# EAGLE design GrooveGrid (EAGLE 8.3.1)
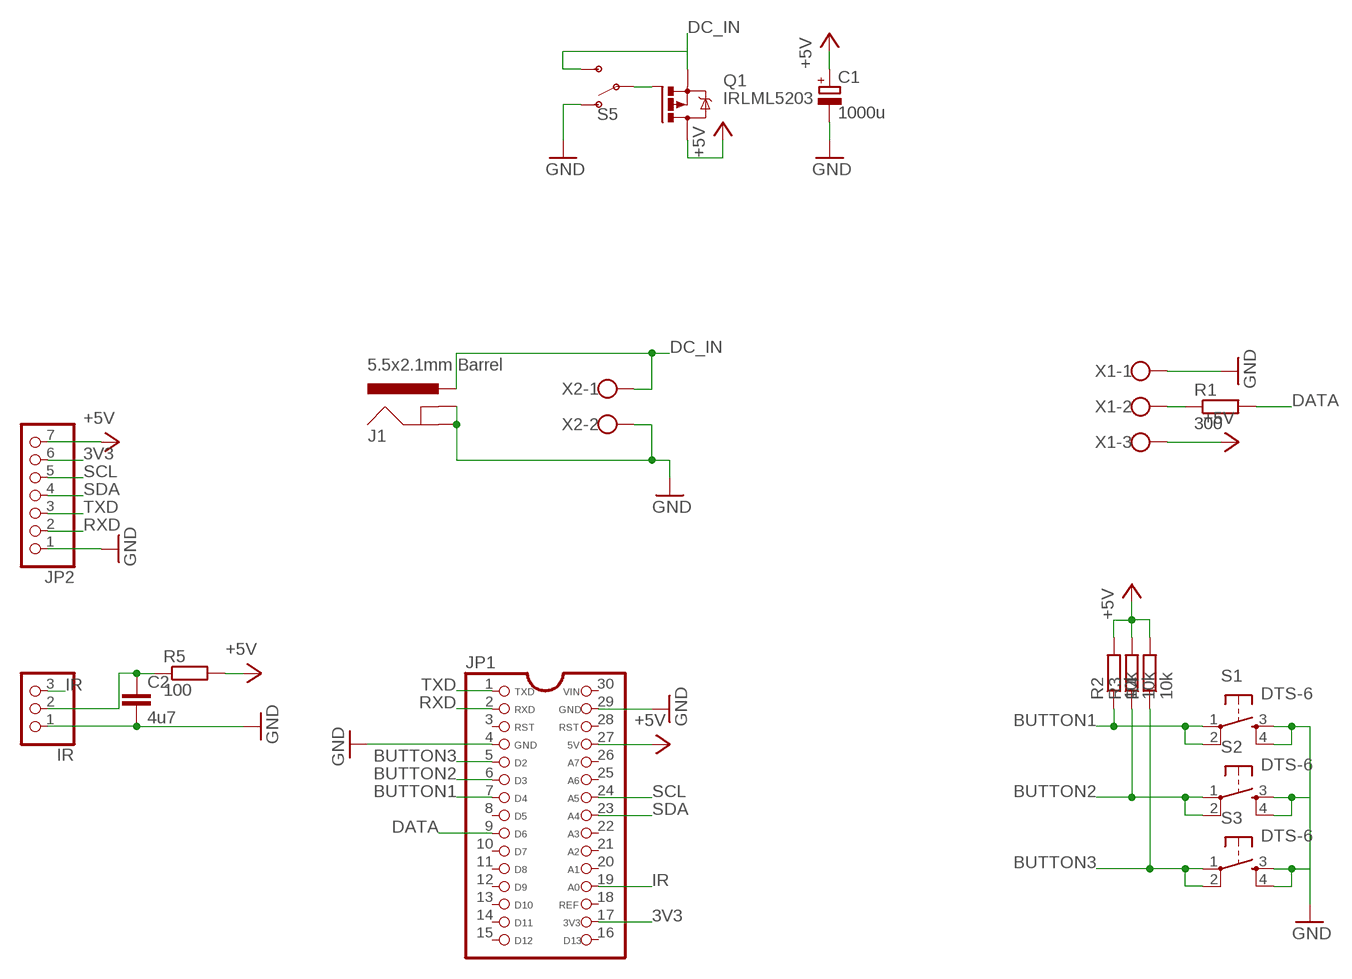
[diagram p0: schematic, sheet 1]

## Parts
C1  1000u  CPOL-EUE3.5-10  [E3,5-10]
C2  4u7  C-EUC0805  [C0805]
IR  PINHD-1X3  [1X03]
J1  5.5x2.1mm Barrel  POWER_JACKSMD  [POWER_JACK_SMD]
JP1  ATMEGA_NANO_MODULE  [ATMEGA_NANO_MODULE]
JP2  PINHD-1X7  [1X07]
Q1  IRLML5203  [MICRO3]
R1  300  R-EU_M0805  [M0805]
R2  10k  R-EU_M0805  [M0805]
R3  10k  R-EU_M0805  [M0805]
R4  10k  R-EU_M0805  [M0805]
R5  100  R-EU_M0805  [M0805]
S1  DTS-6  [DTS-6]
S2  DTS-6  [DTS-6]
S3  DTS-6  [DTS-6]
S5  SWITCH-SPDT-PTH-11.6X4.0MM  [SWITCH_SPDT_PTH_11.6X4.0MM]
X1  W237-103  [W237-103]
X2  W237-102  [W237-102]

## Nets
3V3: JP1.17 JP2.6
+5V: C1.+ JP1.27 JP2.7 Q1.3(D) R2.2 R3.2 R4.2 R5.2 X1.3
BUTTON1: JP1.7 R2.1 S1.1 S1.2
BUTTON2: JP1.6 R3.1 S2.1 S2.2
BUTTON3: JP1.5 R4.1 S3.1 S3.2
DATA: JP1.9 R1.2
DC_IN: J1.VIN0(PWR) Q1.2(S) S5.3(S) X2.1
GND: C1.- C2.2 IR.1 J1.GND(GNDBREAK) J1.P$4(GND) JP1.4 JP1.29 JP2.1 S1.3 S1.4 S2.3 S2.4 S3.3 S3.4 S5.1(O) X1.1 X2.2
IR: IR.3 JP1.19
N$1: C2.1 IR.2 R5.1
N$3: R1.1 X1.2
N$5: Q1.1(G) S5.2(P)
RXD: JP1.2 JP2.2
SCL: JP1.24 JP2.5
SDA: JP1.23 JP2.4
TXD: JP1.1 JP2.3
Unconnected: JP1.3 JP1.8 JP1.10 JP1.11 JP1.12 JP1.13 JP1.14 JP1.15 JP1.16 JP1.18 JP1.20 JP1.21 JP1.22 JP1.25 JP1.26 JP1.28 JP1.30

## Library data of the parts
C1 = resistor:CPOL-EU: POLARIZED CAPACITOR, European symbol
C2 = resistor:C-EU: CAPACITOR, European symbol
IR = pinhead:PINHD-1X3: PIN HEADER
J1 = SparkFun-Connectors:POWER_JACK: Power Jack Connector This is the standard 5.5mm barrel jack for power. The PTH is the most common, proven, reliable, footprint. The Slot footprint only works if the mill layer is transmitted to the PCB fab house so be warned. Here are the connectors we sell at SparkFun: DC Barrel Power Jack/Connector <https://www.sparkfun.com/products/119> (PRT-00119) DC Barrel Power Jack/Connector (SMD) <https://www.sparkfun.com/products/12748> (PRT-12748) DC Barrel Jack Adapter - Breadboard Compatible <https://www.sparkfun.com/products/10811> (PRT-10811) It is used on this SparkFun product (and many, many others): SparkFun RedBoard - Programmed with Arduino <https://www.sparkfun.com/products/12757> (DEV-12757) Also, if you need a mating power supply or connector, please check these out: Wall Adapter Power Supply - 9VDC 650mA <https://www.sparkfun.com/products/298> (TOL-00298) DC Barrel Jack Adapter - Male <https://www.sparkfun.com/products/10287> (PRT-10287); PROD_ID: CONN-08106; SF_ID: PRT-12748
JP1 = phoggy:ATMEGA_NANO_MODULE: PIN HEADER
JP2 = pinhead:PINHD-1X7: PIN HEADER
Q1 = transistor-power:IRLML5203: HEXFET P-Channel Power MOSFET
R1-R5 = resistor:R-EU_: RESISTOR, European symbol
S1-S3 = switch-tact:DTS-6
S5 = SparkFun-Switches:SWITCH-SPDT: Single Pole, Double Throw (SPDT) Switch Single-pole, double-throw (SPDT) switch. Variant Overview SMD-AYZ0202 Surface Mount DPDT Switch <https://www.sparkfun.com/products/597> (COM-00597) Used on e.g. LilyPad Arduino USB - ATmega32U4 Board <https://www.sparkfun.com/products/12049> PTH-11.6X4.0MM SPDT Mini Power Switch <https://www.sparkfun.com/products/102> (COM-00102) Used on e.g. SparkFun Simon Says - Through-Hole Soldering Kit <https://www.sparkfun.com/products/10547> (KIT-10547) PTH-11.6X4.0MM-KIT KIT version of SPDT Mini Power Switch - Simplifies soldering by removing tStop of switch pins - only one side can be soldered. PTH-11.6X4.0MM-LOCK LOCK version of SPDT Mini Power Switch - Offset pins hold switch in place for easier soldering. SMD-RIGHT-ANGLE Surface Mount Right Angle Switch <https://www.sparkfun.com/products/10860> (COM-10860) Used on e.g. SparkFun ESP8266 Thing <https://www.sparkfun.com/products/13231>; PROD_ID: SWCH-08261; SF_SKU: COM-00102
X1 = con-wago-500:W237-103: WAGO SCREW CLAMP; MPN: 237-103; OC_FARNELL: unknown; OC_NEWARK: 18M7116
X2 = con-wago-500:W237-102: WAGO SCREW CLAMP; MPN: 237-102; OC_FARNELL: unknown; OC_NEWARK: 70K9898

## Board
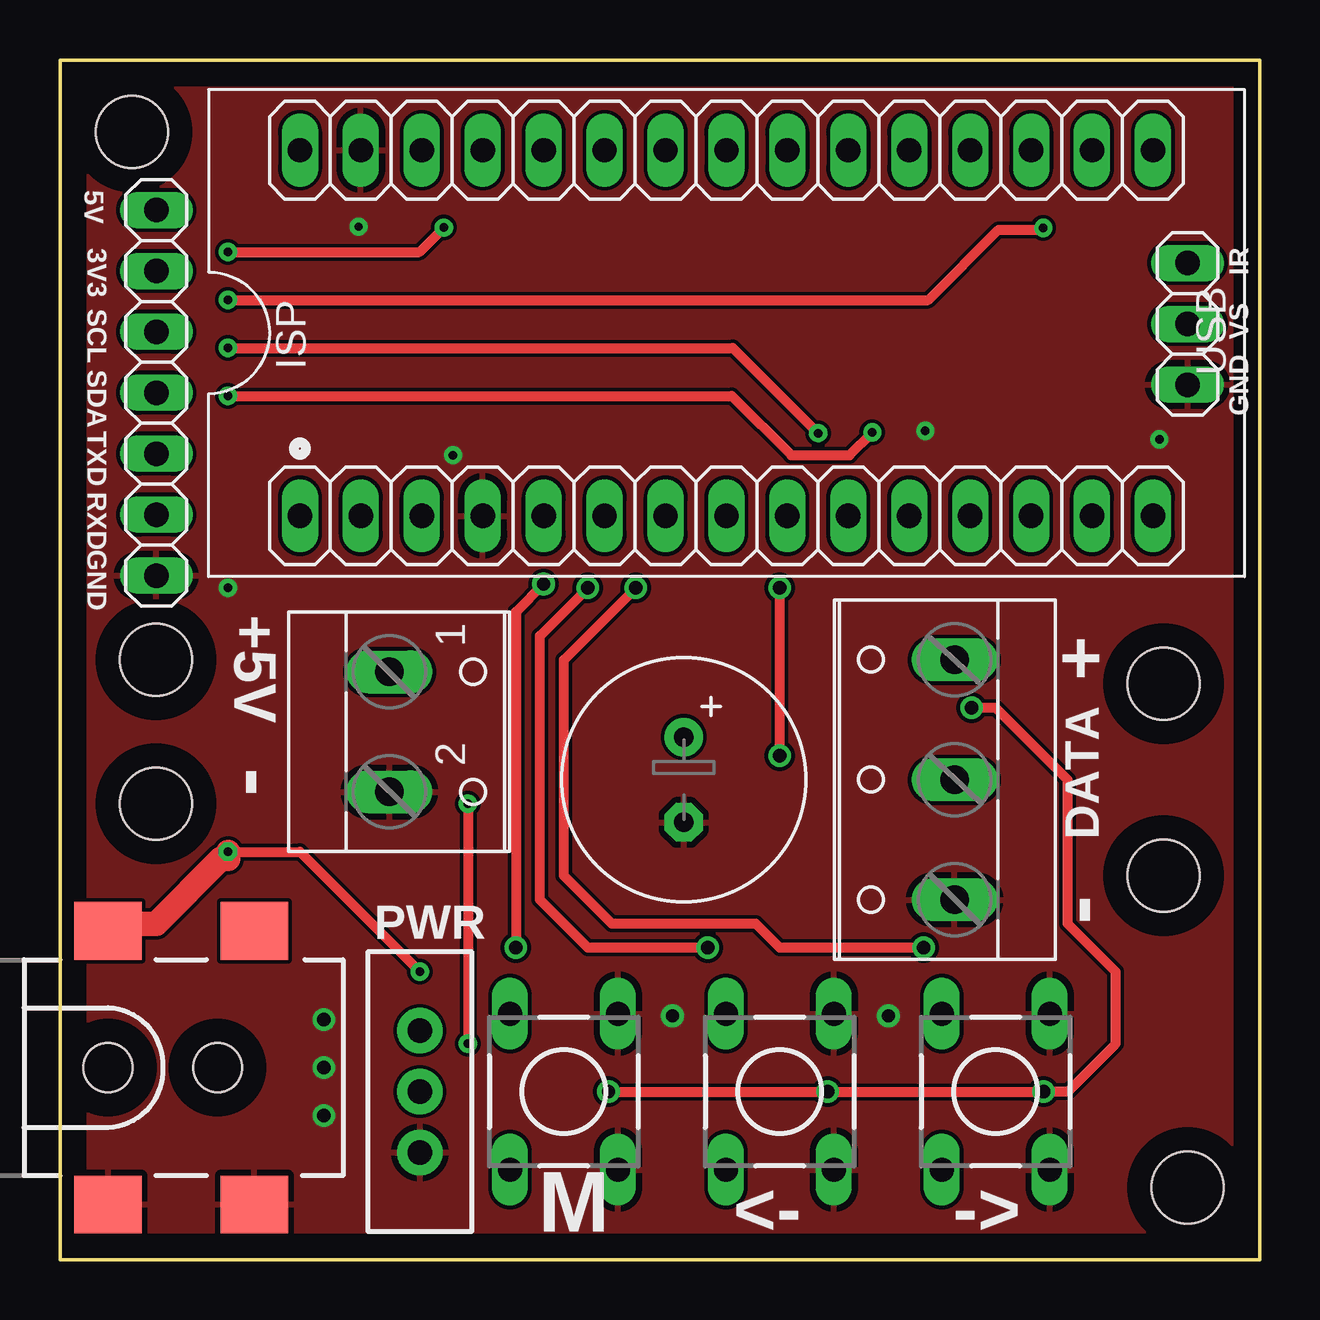
[diagram p1: board, top side]
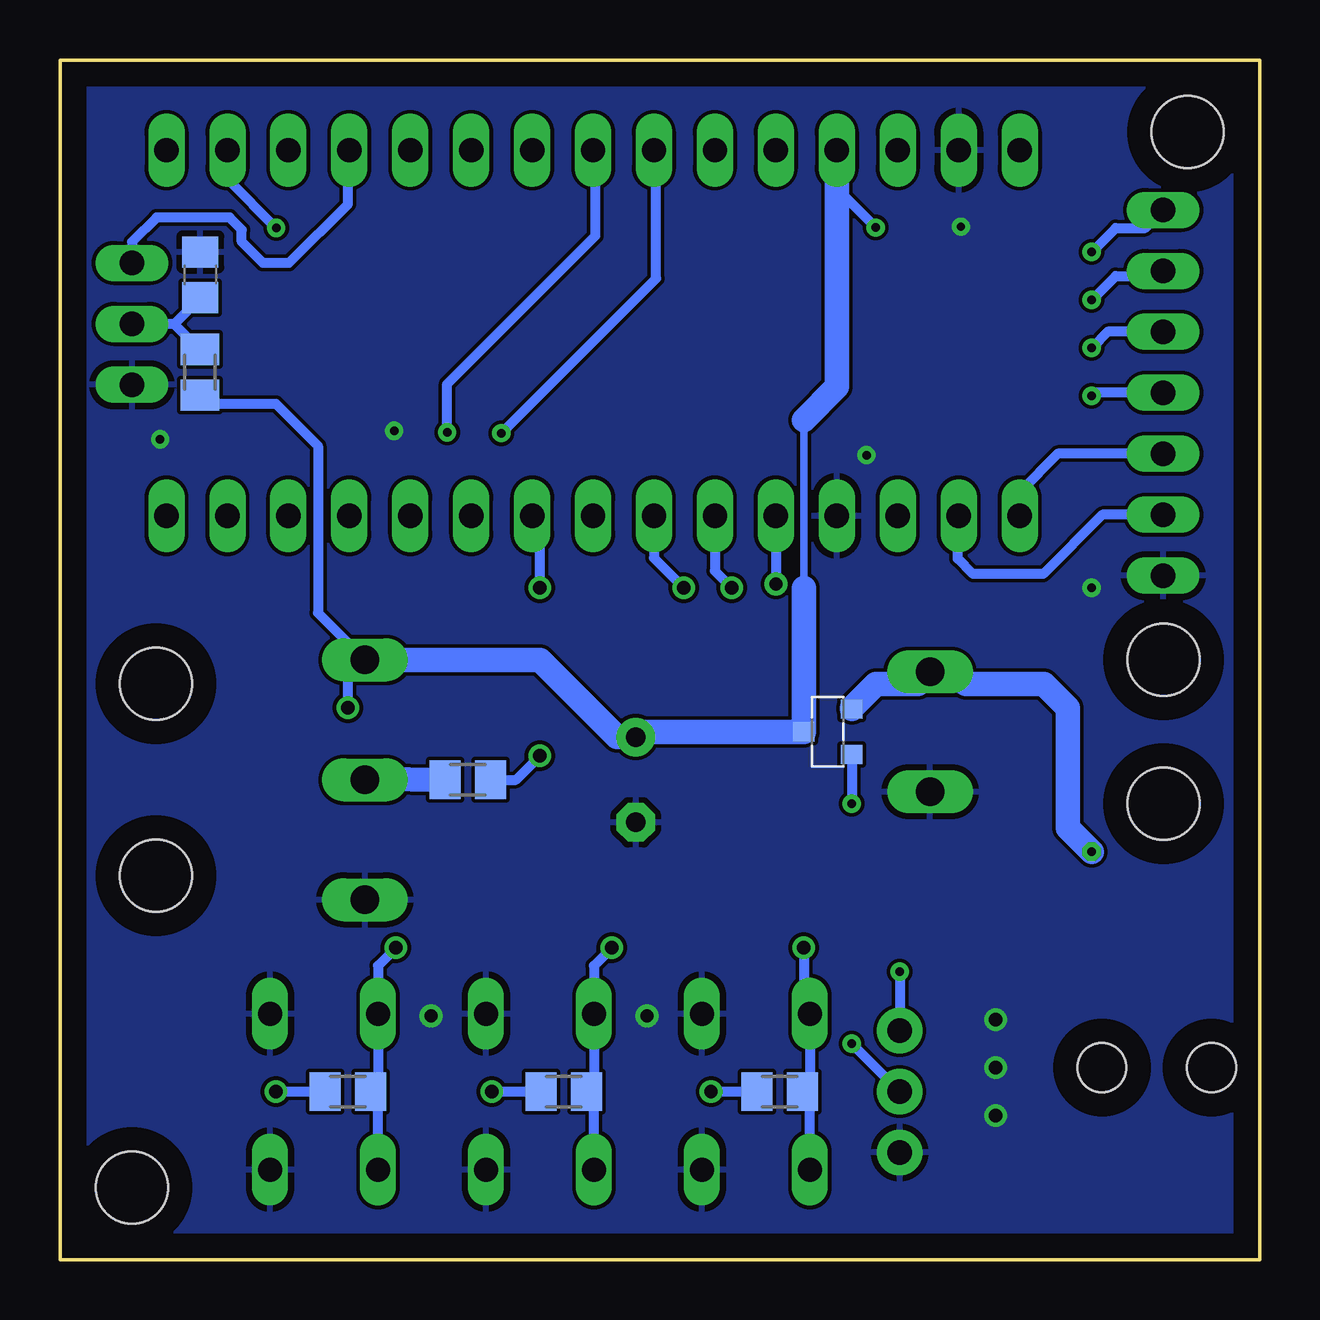
[diagram p2: board, bottom side, seen from below]

Size 50 x 50 mm. Coordinates in mm from the lower left corner, seen from the top.
Outline: 0,0 0,50 50,50 50,0 0,0
Copper layers (1*16): Top 0.035mm / dielectric 1.5mm / Bottom 0.035mm
Design rules "default": minimum track width 6mil, minimum drill 0.35mm, track to track 6mil, track to pad 6mil, pad to pad 6mil, via to via 6mil, smd to smd 6mil, copper to edge 40mil, drill to drill 6mil, minimum pad ring 10mil, minimum via ring 8mil, stop-mask expansion 4mil, vias tented up to drill 0mil, thermal gap 10mil
Holes 3 mm at 3,47 47,3 4,25 4,19 46,16 46,24

### Footprints (pad centres in the part's own frame; a part is rotated, then mirrored left to right if it is on the bottom)
E3,5-10 = drill 0.813 pad 1.6: + -1.778,0 | drill 0.813 pad 1.6 octagon: - 1.778,0
C0805 = smd 1.3 x 1.5: 1 -0.95,0; 2 0.95,0
1X03 = drill 1.016 long: 1 -2.54,0; 2 0,0; 3 2.54,0
POWER_JACK_SMD = smd 2.8 x 2.4: GND 0,-5.7; P$4 6.1,-5.7; VIN0 0,5.7; VIN1 6.1,5.7 | hole 2.032: 0,0; 4.572,0
ATMEGA_NANO_MODULE = drill 1.016 long: 1 0,0; 2 0,-2.54; 3 0,-5.08; 4 0,-7.62; 5 0,-10.16; 6 0,-12.7; 7 0,-15.24; 8 0,-17.78; 9 0,-20.32; 10 0,-22.86; 11 0,-25.4; 12 0,-27.94; 13 0,-30.48; 14 0,-33.02; 15 0,-35.56; 16 15.24,-35.56; 17 15.24,-33.02; 18 15.24,-30.48; 19 15.24,-27.94; 20 15.24,-25.4; 21 15.24,-22.86; 22 15.24,-20.32; 23 15.24,-17.78; 24 15.24,-15.24; 25 15.24,-12.7; 26 15.24,-10.16; 27 15.24,-7.62; 28 15.24,-5.08; 29 15.24,-2.54; 30 15.24,0
1X07 = drill 1.016 long: 1 -7.62,0; 2 -5.08,0; 3 -2.54,0; 4 0,0; 5 2.54,0; 6 5.08,0; 7 7.62,0
MICRO3 = smd 0.8 x 0.9: 1 -0.95,-1; 2 0.95,-1; 3 0,1
M0805 = smd 1.3 x 1.6: 1 -0.95,0; 2 0.95,0
DTS-6 = drill 1 long: 1 -3.25,2.25; 2 3.25,2.25; 3 -3.25,-2.25; 4 3.25,-2.25
SWITCH_SPDT_PTH_11.6X4.0MM = drill 1.016 pad 1.88: 1 0,2.54; 2 0,0; 3 0,-2.54
W237-103 = drill 1.194 long: 1 -5,-1.29; 2 0,-1.29; 3 5,-1.29
W237-102 = drill 1.194 long: 1 -2.5,-1.27; 2 2.5,-1.27

### Placement (x,y rotation side)
C1  26,20 270 top
C2  44.15,41.04 90 bottom
IR  47,39 90 top
J1  2,8 0 top
JP1  10,31 90 top
JP2  4.02,36.13 90 top
Q1  18,22 90 bottom
R1  33,20 0 bottom
R2  38,7 180 bottom
R3  29,7 180 bottom
R4  20,7 180 bottom
R5  44.17,36.98 270 bottom
S1  39,7 90 top
S2  30,7 90 top
S3  21,7 90 top
S5  15,7 180 top
X1  36,20 90 top
X2  15,22 270 top

### Tracks (layer width: path | path; a pad name or v marks a point on that pad's centre or on a via)
3V3  (via drill 0.35)
  Top 0.406: v40.98,43 40.91,42.93 39.12,42.93 36.19,40 v7,40
  Bottom 0.406: v7,40 6,41 4.22,41 JP2.6 | 43,46.22 JP1.17 43.02,45.04 v40.98,43
+5V  (via drill 0.35, 0.55)
  Top 0.406: v22.86,7 v32,7 v41,7 42,7 44,9 44,12 42,14 42,20 39,23 v38,23 | v7,42 14.98,42 v16,43.02
  Bottom 0.305: 19,35 19,28
  Bottom 0.406: R4.2 v22.86,7 23,7 | R3.2 v32,7 | R2.2 v41,7 | v38,23 38,24.71 X1.3 39.24,26.95 39.24,33.91 41,35.67 43.8,35.67 R5.2 | v7,42 6,43 4.76,43 JP2.7 | JP1.27 17.62,44.64 v16,43.02
  Bottom 1.016: 38,25 X1.3 30,25 26.78,21.78 C1.+ 25.78,22 Q1.3 19,28 | JP1.27 17.62,36.38 19,35
BUTTON1  (via drill 0.55)
  Top 0.406: v36,13 30,13 29,14 23,14 21,16 21,25 v24,28
  Bottom 0.406: v36,13 36.75,12.25 S1.2 36.75,7.3 R2.1 36.75,6.7 S1.1 | JP1.7 25.24,29.24 v24,28
BUTTON2  (via drill 0.55)
  Top 0.406: v27,13 22,13 20,15 20,26 v22,28
  Bottom 0.406: v27,13 27.75,12.25 S2.2 27.75,7.3 R3.1 27.75,6.7 S2.1 | JP1.6 22.7,28.7 v22,28
BUTTON3  (via drill 0.55)
  Top 0.406: v20.16,28.16 19,27 v19,13
  Bottom 0.406: v19,13 19,10.5 S3.2 18.75,7.3 R4.1 18.75,6.7 S3.1 | JP1.5 v20.16,28.16 20,28
DATA  (via drill 0.55)
  Top 0.406: v30,21 v30,28
  Bottom 0.406: R1.2 31,20 v30,21 | v30,28 30,30.68 JP1.9
DC_IN  (via drill 0.35)
  Top 0.406: v7,17 10,17 v15,12
  Top 1.016: v7,17 7,16.7 6.7,16.7 4,14 2.3,14 J1.VIN0
  Bottom 0.406: v15,12 S5.3
  Bottom 1.016: v7,17 8,18 8,23 9,24 12.23,24 12.73,24.5 X2.1 14.23,24 16,24 17,23 Q1.2
GND  (via drill 0.35, 0.55)
  other vias: 11,10 11,8 11,6 25.53,10.16 34.53,10.16 12.45,43.05 16.38,33.53 7,28 45.83,34.19 36.07,34.54
  pour Top: 0,50 50,50 50,0 0,0
  pour Bottom: 0,50 50,50 50,0 0,0
IR
  Bottom 0.406: JP1.19 38,46.18 38,44 40.46,41.54 41.54,41.54 42.42,42.42 42.42,42.93 42.93,43.43 45.97,43.43 46.99,42.42 IR.3
N$1
  Bottom 0.406: 45.24,39 IR.2 | 45.24,39 R5.1 | C2.1 45.24,39
N$3
  Bottom 1.016: R1.1 38.24,20.05 X1.2
N$5  (via drill 0.35)
  Top 0.406: v17,19 v17,9
  Bottom 0.406: Q1.1 v17,19 | S5.2 v17,9
RXD
  Bottom 0.406: JP2.2 6.54,31.05 9.02,28.57 11.94,28.57 12.57,29.21 12.57,30.97 JP1.2
SCL  (via drill 0.35)
  Top 0.406: v31.6,34.44 28.05,38 v7,38
  Bottom 0.406: JP2.5 6.33,38.67 v7,38 | v31.6,34.44 25.15,40.89 25.15,46.15 JP1.24
SDA  (via drill 0.35)
  Top 0.406: v33.86,34.48 32.91,33.53 30.48,33.53 28.01,36 v7,36
  Bottom 0.406: JP2.4 6.87,36.13 v7,36 | v33.86,34.48 33.86,36.5 27.69,42.67 27.69,46.15 JP1.23
TXD
  Bottom 0.406: JP2.3 8.41,33.59 10,32 JP1.1

### Text on the board
tPlace: 5V | 3V3 | IR | SCL | VS | SDA | TXD | GND | RXD | GND | +5V | + | - | DATA | - | PWR | M | <- | ->